# Altium schematic sheet A dashBoard of Voltage and Current Data Loggers and Recorders.SchDoc
size A4
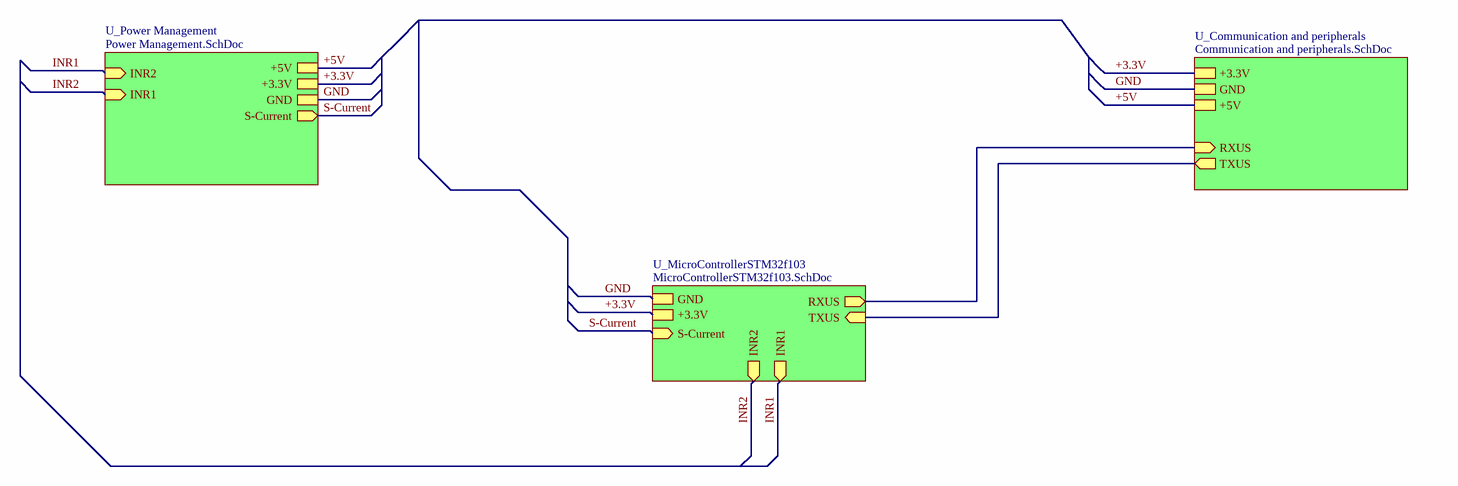
[diagram p0: A dashBoard of Voltage and Current Data Loggers and Recorders.SchDoc]

## Sub-sheets
U_Communication and peripherals = Communication and peripherals.SchDoc: TXUS (out), RXUS (in), GND, +5V, +3.3V
U_MicroControllerSTM32f103 = MicroControllerSTM32f103.SchDoc: GND, +3.3V, RXUS (out), TXUS (in), INR1 (out), INR2 (out), S-Current (in)
U_Power Management = Power Management.SchDoc: +5V, +3.3V, GND, S-Current (out), INR2 (in), INR1 (in)

## Nets
+3.3V: sheet U_Communication and peripherals/+3.3V, sheet U_Power Management/+3.3V, sheet U_MicroControllerSTM32f103/+3.3V
+5V: sheet U_Communication and peripherals/+5V, sheet U_Power Management/+5V
GND: sheet U_Communication and peripherals/GND, sheet U_Power Management/GND, sheet U_MicroControllerSTM32f103/GND
INR1: sheet U_Power Management/INR2, sheet U_MicroControllerSTM32f103/INR1
INR2: sheet U_Power Management/INR1, sheet U_MicroControllerSTM32f103/INR2
S-Current: sheet U_Power Management/S-Current, sheet U_MicroControllerSTM32f103/S-Current
(unnamed): sheet U_Communication and peripherals/TXUS, sheet U_MicroControllerSTM32f103/TXUS
(unnamed): sheet U_Communication and peripherals/RXUS, sheet U_MicroControllerSTM32f103/RXUS

## Notes on the sheet
- Title
- Size:
- Data:
- CompanyName:
- A4
- Number:
- Time:
- Revision:
- Engineer:
- File: